# Altium schematic sheet MCU.SchDoc
size A4; SheetNumber: 3; SheetTotal: 4
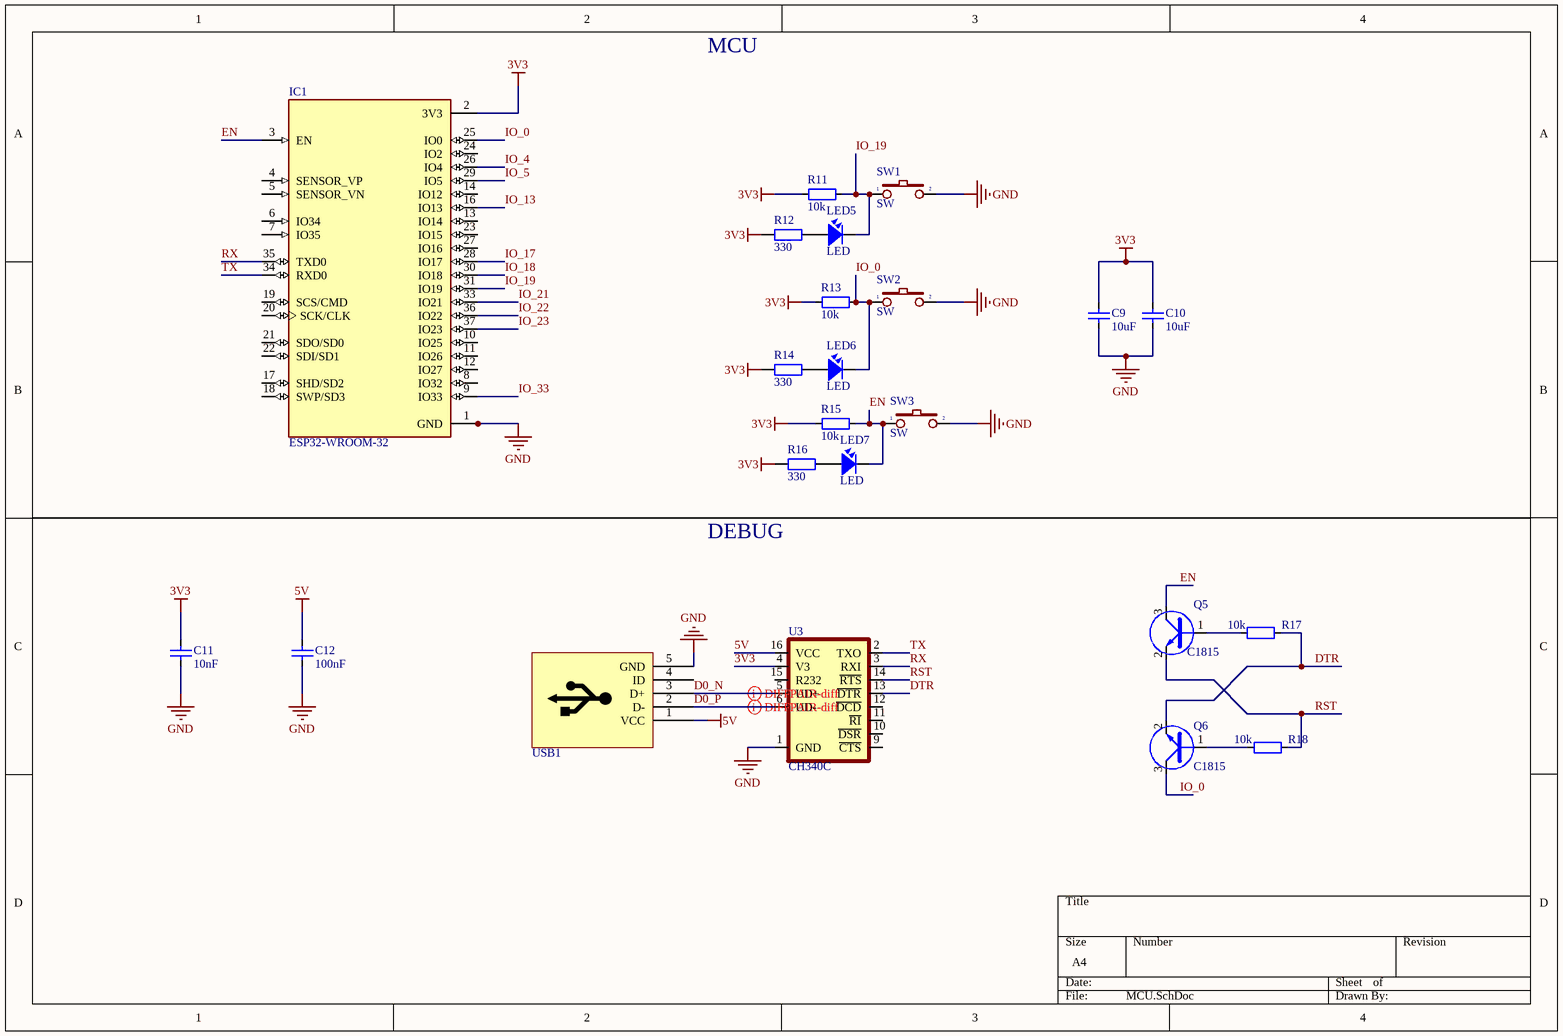
[diagram p0: MCU.SchDoc]

## Parts
C9  10uF  [CAP_0805]
C10  10uF  [CAP_0805]
C11  10nF  [CAP_0805]
C12  100nF  [CAP_0805]
IC1  ESP32-WROOM-32  [MODULE_ESP32-WROOM-32]
LED5  LED  [LED-0805-Blue]
LED6  LED  [LED-0805-Blue]
LED7  LED  [LED-0805-Blue]
Q5  C1815  [SOT23D]
Q6  C1815  [SOT23D]
R11  10k  [RES-SMD-0805]
R12  330  [RES-SMD-0805]
R13  10k  [RES-SMD-0805]
R14  330  [RES-SMD-0805]
R15  10k  [RES-SMD-0805]
R16  330  [RES-SMD-0805]
R17  10k  [RES-SMD-0805]
R18  10k  [RES-SMD-0805]
SW1  SW  [BUTTON_2_SMD]
SW2  SW  [SW_B3U-1000P]
SW3  SW  [SW_B3U-1000P]
U3  CH340C  [SOP-16]
USB1  USB  [USB-M1]  (value not drawn)

## Nets
3V3: C9.1 C10.1 C11.1 IC1.2(3V3) R11.2 R12.2 R13.2 R14.2 R15.2 R16.2 U3.4(V3)
5V: C12.1 U3.16(VCC) USB1.1(VCC)
GND: C9.2 C10.2 C11.2 C12.2 IC1.1(GND) IC1.15(GND) IC1.38(GND) IC1.39_1(GND) IC1.39_2(GND) IC1.39_3(GND) IC1.39_4(GND) IC1.39_5(GND) IC1.39_6(GND) IC1.39_7(GND) IC1.39_8(GND) IC1.39_9(GND) IC1.39_10(GND) IC1.39_11(GND) IC1.39_12(GND) IC1.39_13(GND) IC1.39_14(GND) IC1.39_15(GND) IC1.39_16(GND) IC1.39_17(GND) IC1.39_18(GND) IC1.39_19(GND) IC1.39_20(GND) IC1.39_21(GND) SW1.2 SW2.2 SW3.2 U3.1(GND) USB1.5(GND)
D0_N: U3.5(UD+) USB1.3(D+)
D0_P: U3.6(UD-) USB1.2(D-)
DTR: Q6.2(E) R17.1 U3.13(~{DTR})
EN: IC1.3(EN) LED7.2 Q5.3(C) R15.1 SW3.1
IO_0: IC1.25(IO0) LED6.2 Q6.3(C) R13.1 SW2.1
IO_4: IC1.26(IO4)
IO_5: IC1.29(IO5)
IO_13: IC1.16(IO13)
IO_17: IC1.28(IO17)
IO_18: IC1.30(IO18)
IO_19: IC1.31(IO19) LED5.2 R11.1 SW1.1
IO_21: IC1.33(IO21)
IO_22: IC1.36(IO22)
IO_23: IC1.37(IO23)
IO_33: IC1.9(IO33)
RST: Q5.2(E) R18.1 U3.14(~{RTS})
RX: IC1.35(TXD0) U3.3(RXI)
TX: IC1.34(RXD0) U3.2(TXO)
NetLED5_1: LED5.1 R12.1
NetLED6_1: LED6.1 R14.1
NetLED7_1: LED7.1 R16.1
NetQ5_1: Q5.1(B) R17.2
NetQ6_1: Q6.1(B) R18.2

Not connected (* = marked no-connect by the designer): IC1 4(SENSOR_VP) 5(SENSOR_VN) 6(IO34) 7(IO35) 8(IO32) 10(IO25) 11(IO26) 12(IO27) 13(IO14) 14(IO12) 17(SHD/SD2) 18(SWP/SD3) 19(SCS/CMD) 20(SCK/CLK) 21(SDO/SD0) 22(SDI/SD1) 23(IO15) 24(IO2) 27(IO16); U3 9(~{CTS}) 10(~{DSR}) 11(~{RI}) 12(~{DCD}) 15(R232); USB1 4(ID)

## Layout directives
differential pair; differential pair class diff: D0_N, D0_P

## Notes on the sheet
- MCU
- DEBUG

## Library data of the parts
C9-C12 = CapSMD: Capacitor; Value: 33p; Published: 8-Jun-2000; LatestRevisionDate: 17-Jul-2002; LatestRevisionNote: Re-released for DXP Platform.; PackageReference: RAD-0.3; Publisher: Altium Limited
IC1 = ESP32-WROOM-32: Bluetooth, WiFi Transceiver Module 2.4GHz ~ 2.5GHz Surface Mount; MF: Espressif Systems; Package: Module Espressif Systems; Digi-Key_Part_Number: 1904-1010-1-ND; Digi-Key_Purchase_URL: https://www.digikey.com/product-detail/en/espressif-systems/ESP32-WROOM-32/1904-1010-1-ND/8544305?utm_source=snapeda&utm_medium=aggregator&utm_campaign=symbol; Value: *; MP: ESP32-WROOM-32; SnapEDA_Link: https://www.snapeda.com/parts/ESP32-WROOM-32/Espressif%20Systems/view-part/2753322/?ref=snap
LED5-LED7 = LED: LED Single colour Green and Red; Value: LED 3 ly Single Colour
Q5 Q6 = 2SC1815: NPN 600mW, ECB; Value: C1815
R11 R13 R15 R17 R18 = Resistor - SMD: Resistor; Manufacturer: Generic Components; Class: Passive; Published: 08/06/2000; Publisher: Altium Hobart Technology Centre
R12 R14 R16 = Resistor - SMD: Resistor SMD; Manufacturer: Generic Components; Class: Passive; Published: 08/06/2000; Publisher: Altium Hobart Technology Centre
SW1-SW3 = SW2: https://linhkien.cxt.vn/1779-nut-nhan-smd-2p.html; Value: SW chip 2 pin
U3 = CH340C: https://linhkien.cxt.vn/4690-ch340c-ic-transceiver-2mbps-usb20-sop-16.html; MF: WCH; Package: Package; Check_prices: https://www.snapeda.com/parts/CH340C/WCH/view-part/5428851/?ref=eda; Value: *; Price: None; MP: CH340C; Availability: Unavailable; SnapEDA_Link: https://www.snapeda.com/parts/CH340C/WCH/view-part/5428851/?ref=snap
USB1 = USB-M